# EAGLE design NeoDigito Mini V2 (EAGLE 9.6.2)
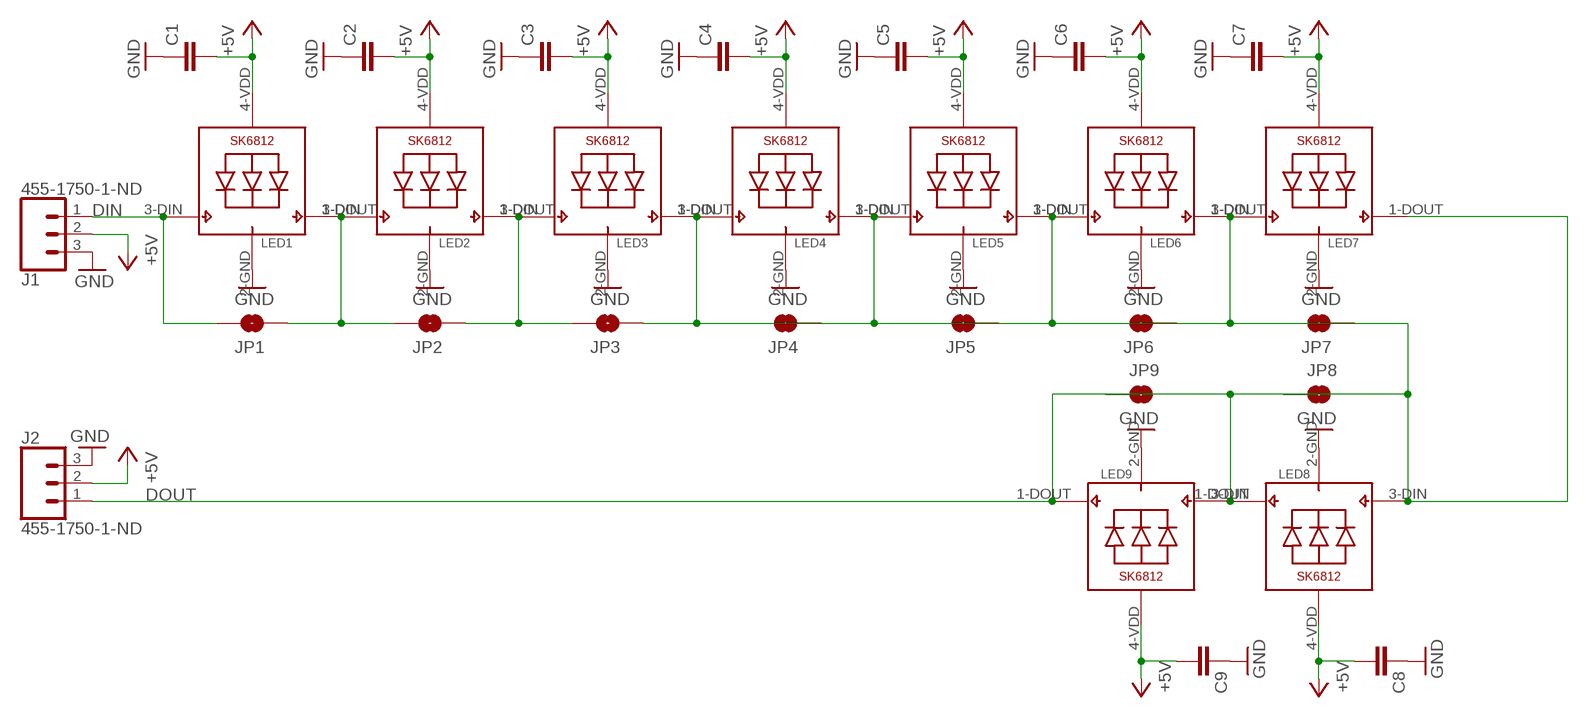
[diagram p0: schematic, sheet 1]

## Parts
C1  C-EUC0805  [C0805]
C2  C-EUC0805  [C0805]
C3  C-EUC0805  [C0805]
C4  C-EUC0805  [C0805]
C5  C-EUC0805  [C0805]
C6  C-EUC0805  [C0805]
C7  C-EUC0805  [C0805]
C8  C-EUC0805  [C0805]
C9  C-EUC0805  [C0805]
J1  455-1750-1-ND  CONN_03  [1X03]
J2  455-1750-1-ND  CONN_03  [1X03]
JP1  JUMPER-SMT_2_NO_SILK  [SMT-JUMPER_2_NO_SILK]
JP2  JUMPER-SMT_2_NO_SILK  [SMT-JUMPER_2_NO_SILK]
JP3  JUMPER-SMT_2_NO_SILK  [SMT-JUMPER_2_NO_SILK]
JP4  JUMPER-SMT_2_NO_SILK  [SMT-JUMPER_2_NO_SILK]
JP5  JUMPER-SMT_2_NO_SILK  [SMT-JUMPER_2_NO_SILK]
JP6  JUMPER-SMT_2_NO_SILK  [SMT-JUMPER_2_NO_SILK]
JP7  JUMPER-SMT_2_NO_SILK  [SMT-JUMPER_2_NO_SILK]
JP8  JUMPER-SMT_2_NO_SILK  [SMT-JUMPER_2_NO_SILK]
JP9  JUMPER-SMT_2_NO_SILK  [SMT-JUMPER_2_NO_SILK]
LED1  SK6812_3535  [LED3535]
LED2  SK6812_3535  [LED3535]
LED3  SK6812_3535  [LED3535]
LED4  SK6812_3535  [LED3535]
LED5  SK6812_3535  [LED3535]
LED6  SK6812_3535  [LED3535]
LED7  SK6812_3535  [LED3535]
LED8  SK6812_3535  [LED3535]
LED9  SK6812_3535  [LED3535]

## Nets
+5V: C1.2 C2.2 C3.2 C4.2 C5.2 C6.2 C7.2 C8.2 C9.2 J1.2 J2.2 LED1.4-VDD(VDD) LED2.4-VDD(VDD) LED3.4-VDD(VDD) LED4.4-VDD(VDD) LED5.4-VDD(VDD) LED6.4-VDD(VDD) LED7.4-VDD(VDD) LED8.4-VDD(VDD) LED9.4-VDD(VDD)
DIN: J1.1 JP1.1 LED1.3-DIN(DI)
DOUT: J2.1 JP9.1 LED9.1-DOUT(DO)
GND: C1.1 C2.1 C3.1 C4.1 C5.1 C6.1 C7.1 C8.1 C9.1 J1.3 J2.3 LED1.2-GND(GND) LED2.2-GND(GND) LED3.2-GND(GND) LED4.2-GND(GND) LED5.2-GND(GND) LED6.2-GND(GND) LED7.2-GND(GND) LED8.2-GND(GND) LED9.2-GND(GND)
N$1: JP1.2 JP2.1 LED1.1-DOUT(DO) LED2.3-DIN(DI)
N$2: JP2.2 JP3.1 LED2.1-DOUT(DO) LED3.3-DIN(DI)
N$3: JP3.2 JP4.2 LED3.1-DOUT(DO) LED4.3-DIN(DI)
N$4: JP4.1 JP5.2 LED4.1-DOUT(DO) LED5.3-DIN(DI)
N$5: JP5.1 JP6.2 LED5.1-DOUT(DO) LED6.3-DIN(DI)
N$6: JP6.1 JP7.2 LED6.1-DOUT(DO) LED7.3-DIN(DI)
N$7: JP8.1 JP9.2 LED8.1-DOUT(DO) LED9.3-DIN(DI)
N$13: JP7.1 JP8.2 LED7.1-DOUT(DO) LED8.3-DIN(DI)

## Library data of the parts
C1-C9 = rcl:C-EU: CAPACITOR, European symbol; SPICEPREFIX: C
J1 J2 = SparkFun-Connectors:CONN_03: Multi connection point. Often used as Generic Header-pin footprint for 0.1 inch spaced/style header connections On any of the 0.1 inch spaced packages, you can populate with these: Break Away Headers - Straight <https://www.sparkfun.com/products/116> (PRT-00116) Break Away Male Headers - Right Angle <https://www.sparkfun.com/products/553> (PRT-00553) Female Headers <https://www.sparkfun.com/products/115> (PRT-00115) Break Away Headers - Machine Pin <https://www.sparkfun.com/products/117> (PRT-00117) Break Away Female Headers - Swiss Machine Pin <https://www.sparkfun.com/products/743> (PRT-00743) Stackable Header - 3 Pin (Female, 0.1") <https://www.sparkfun.com/products/13875> (PRT-13875) For SCREWTERMINALS and SPRING TERMINALS visit here: Screw Terimnals on SparkFun.com <https://www.sparkfun.com/search/results?term=Screw+Terminals> (5mm/3.5mm/2.54mm spacing) This device is also useful as a general connection point to wire up your design to another part of your project. Our various solder wires solder well into these plated through hole pads. Hook-Up Wire - Assortment (Stranded, 22 AWG) <https://www.sparkfun.com/products/11375> (PRT-11375) Hook-Up Wire - Assortment (Solid Core, 22 AWG) <https://www.sparkfun.com/products/11367> (PRT-11367) View the entire wire category on our website here <https://www.sparkfun.com/categories/141> Special notes: Molex polarized connector foot print use with SKU : PRT-08232 with associated crimp pins and housings.; PROD_ID: XXX-00000
JP1-JP9 = SparkFun-Jumpers:JUMPER-SMT_2_NO: Normally open jumper This jumper has two pads in close proximity to each other. Apply solder to close the connection. Round pads are easier to solder for beginners, but are a lot larger. SparkFun Product that uses the round pads: SparkFun EL Sequencer <https://www.sparkfun.com/products/12781>
LED1-LED9 = SK6812:SK6812

## Board
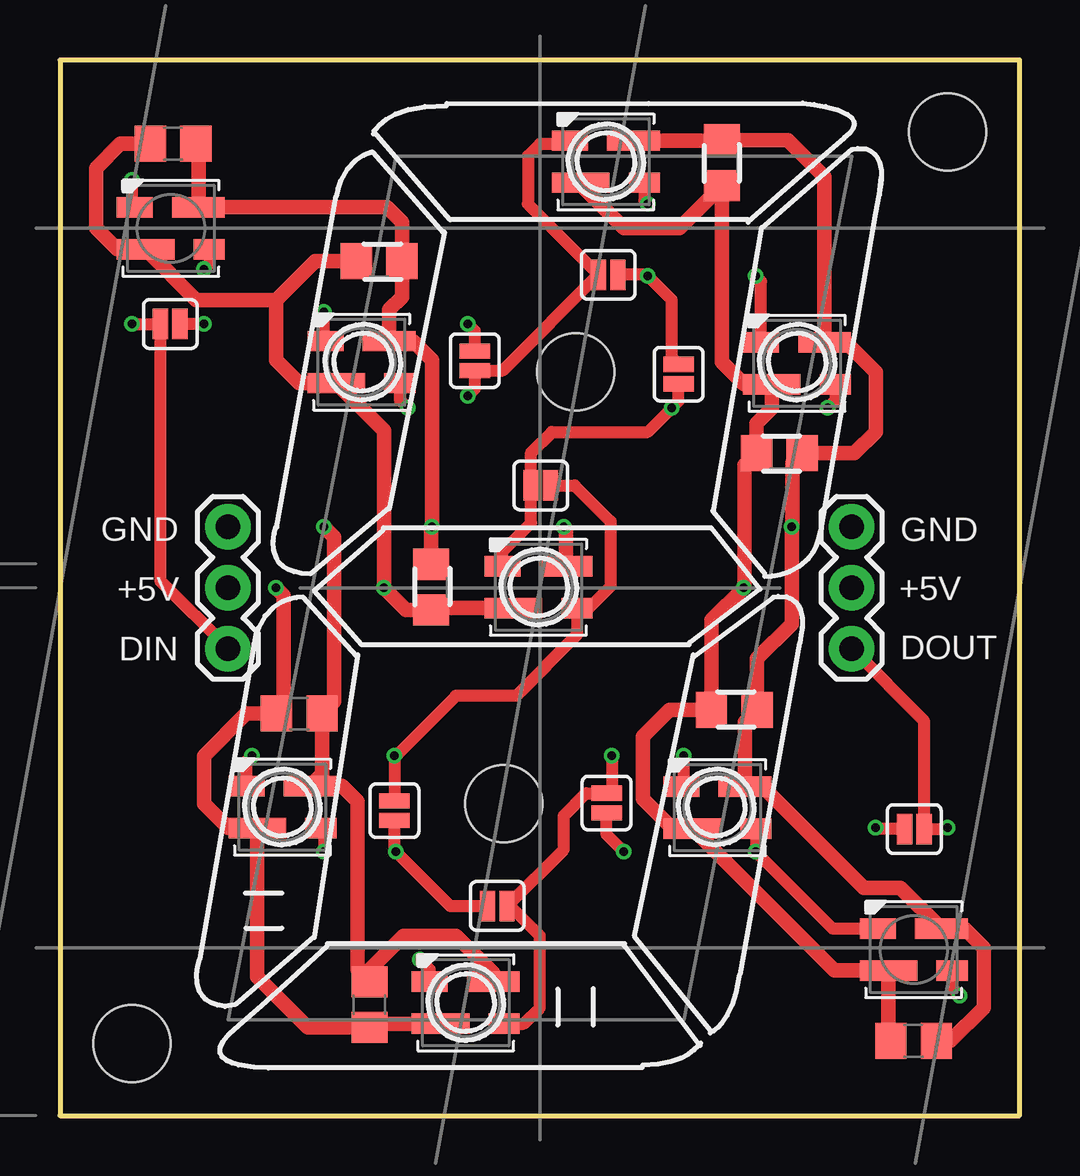
[diagram p1: board, top side]
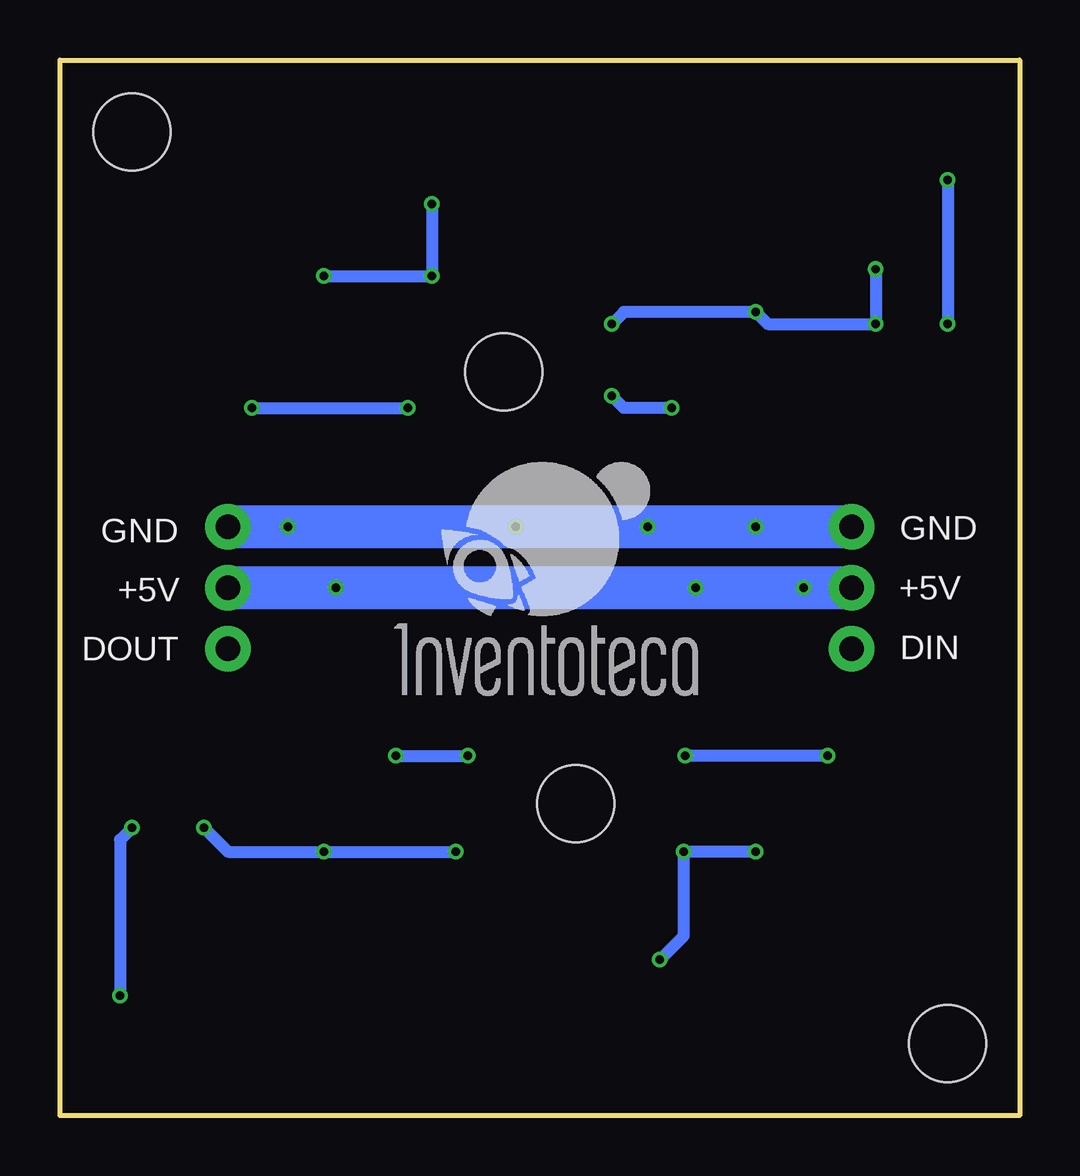
[diagram p2: board, bottom side, seen from below]

Size 40 x 44 mm. Coordinates in mm from the lower left corner, seen from the top.
Outline: 0,0 40,0 40,44 0,44 0,0
Copper layers (1*16): Top 0.035mm / dielectric 1.5mm / Bottom 0.035mm
Design rules "_xircuitos.mx_2L_DRC": minimum track width 6mil, minimum drill 12mil, track to track 6mil, track to pad 6mil, pad to pad 6mil, via to via 6mil, smd to smd 0mil, copper to edge 10mil, drill to drill 12mil, minimum pad ring 10mil, minimum via ring 6mil, stop-mask expansion 2mil, vias tented up to drill 100mil, thermal gap 10mil
Holes 3.2 mm at 3,3 37,41 18.5,13 21.5,31

### Footprints (pad centres in the part's own frame; a part is rotated, then mirrored left to right if it is on the bottom)
C0805 = smd 1.3 x 1.5: 1 -0.95,0; 2 0.95,0
1X03 = drill 1.016 pad 1.88: 1 0,0; 2 2.54,0; 3 5.08,0
SMT-JUMPER_2_NO_SILK = smd 0.635 x 1.27: 1 -0.406,0; 2 0.406,0
LED3535 = smd 1.3 x 0.85: 1-DOUT 1.6,-0.875 | smd 2.2 x 0.85: 2-GND 1.15,0.875 | smd 1.5 x 0.85: 3-DIN -1.5,0.875 | smd 2.4 x 0.85: 4-VDD -1.05,-0.875

### Placement (x,y rotation side)
C1  4.72,40.51 180 top
C2  13.3,35.62 180 top
C3  27.58,39.72 270 top
C4  29.99,27.62 180 top
C5  15.46,22.03 270 top
C6  9.97,16.75 180 top
C7  12.9,4.62 270 top
C8  28.11,16.91 180 top
C9  35.58,3.11 180 top
J1  7,19.46 90 top
J2  33,19.46 90 top
JP1  4.6,32.99 0 top
JP2  17.29,31.46 270 top
JP3  22.86,35.04 0 top
JP4  25.79,30.9 90 top
JP5  20.04,26.26 180 top
JP6  13.94,12.71 90 top
JP7  18.23,8.74 180 top
JP8  22.78,13.03 90 top
JP9  35.61,11.94 180 top
LED1  4.62,36.98 0 top
LED2  12.57,31.41 0 top
LED3  22.76,39.76 0 top
LED4  30.72,31.36 0 top
LED5  19.95,22.03 0 top
LED6  9.27,12.86 0 top
LED7  16.91,4.7 0 top
LED8  27.41,12.84 0 top
LED9  35.59,6.92 0 top

### Tracks (layer width: path | path; a pad name or v marks a point on that pad's centre or on a via)
+5V  (via drill 0.35)
  Top 0.6: 9,34 9,31.5 9.97,30.53 LED2.4-VDD 13.5,28.55 v13.5,22 14.42,21.08 C5.2 15.54,21.15 LED5.4-VDD | 9,34 10.62,35.62 C2.2 | LED3.4-VDD 21.71,38.79 23.5,37 25.82,37 C3.2 27.58,31.42 28.52,30.48 LED4.4-VDD 29.67,29.48 29.04,28.85 C4.2 28.54,27.12 28.54,22.04 v28.5,22 27.16,20.66 C8.2 25.41,16.91 24.3,15.8 24.3,13.2 25.54,11.96 LED8.4-VDD 32.27,6.04 LED9.4-VDD 34.54,3.2 C9.2 | C1.2 2.51,40.51 1.5,39.5 1.5,37 2.39,36.11 LED1.4-VDD 5.68,34 9,34 | v9,22 9.32,21.68 9.32,17.05 C6.2 7.75,16.75 6,15 6,13 7.02,11.98 LED6.4-VDD 8.22,5.78 10.32,3.67 C7.2 13.05,3.83 LED7.4-VDD
  Bottom 1.8: J1.2 v9,22 v13.5,22 v28.5,22 J2.2
DIN  (via drill 0.35)
  Top 0.5: J1.1 4.19,22.27 JP1.1 v3,33 | LED1.3-DIN 3,37.98 v3,39
  Bottom 0.5: v3,39 v3,33
DOUT  (via drill 0.35)
  Top 0.5: v37,12 36.94,11.94 JP9.1 36.02,16.44 J2.1 | v37.5,5 37.19,5.31 LED9.1-DOUT
  Bottom 0.5: v37,12 37.5,11.5 v37.5,5
GND  (via drill 0.35)
  Top 0.6: LED3.2-GND 27.55,40.63 C3.1 30.34,40.66 31.87,39.13 LED4.2-GND 32.77,32.23 34,31 34,28.5 33.12,27.62 C4.1 30.54,27.22 30.54,24.58 v30.5,24.54 30.5,20.5 29.06,19.06 C8.1 28.56,16.41 LED8.2-GND 29.29,13.71 33.5,9.5 35.03,9.5 LED9.2-GND 37.71,7.79 38.5,7 38.5,4.5 37.11,3.11 C9.1 | C1.1 5.77,40.41 LED1.2-GND 13.64,37.86 14.25,37.25 C2.1 14.25,34.12 13.71,33.59 LED2.2-GND 14.72,32.28 15.5,31.5 v15.5,24.54 15.46,24.5 C5.1 | LED5.2-GND 21.1,24.44 v21,24.54 | v11,24.54 11.42,24.12 11.42,17.25 C6.1 10.92,14.24 LED6.2-GND 11.77,13.73 12.4,13.1 12.4,6.08 C7.1 12.9,6.08 14.32,7.5 16.5,7.5 18.07,5.93 LED7.2-GND
  Bottom 1.8: J1.3 v11,24.54 v15.5,24.54 v21,24.54 v30.5,24.54 J2.3
N$1  (via drill 0.35)
  Top 0.5: LED2.3-DIN 11,32.35 v11,33.5 | v6,33 v5.99,32.99 JP1.2 | LED1.1-DOUT 6.22,35.5 v6,35.28 | v17,33 17.29,32.71 JP2.1
  Bottom 0.5: v6,35.28 v6,33 10.5,33 v11,33.5 16.5,33.5 v17,33
N$2  (via drill 0.35)
  Top 0.5: LED2.1-DOUT 14.16,29.84 v14.5,29.5 | v17,30 17.29,30.29 JP2.2 18.46,31.06 JP3.1 19.5,38 19.5,40 20,40.5 21.13,40.5 LED3.3-DIN
  Bottom 0.5: v14.5,29.5 16.5,29.5 v17,30
N$3  (via drill 0.35)
  Top 0.5: LED3.1-DOUT 24.36,38.14 v24.5,38 | JP3.2 24.46,35.04 v24.5,35 25.5,34 25.5,31.6 JP4.2 | LED4.3-DIN 29.22,34.78 v29,35
  Bottom 0.5: v24.5,38 v24.5,35 v29,35
N$4  (via drill 0.35)
  Top 0.5: LED5.3-DIN 18.45,23.52 19.64,24.71 JP5.2 19.64,27.64 20.5,28.5 24.5,28.5 v25.5,29.5 25.79,29.79 JP4.1 | LED4.1-DOUT 32.32,29.82 v32,29.5
  Bottom 0.5: v32,29.5 v25.5,29.5
N$5  (via drill 0.35)
  Top 0.5: JP5.1 21.45,26.26 22.95,24.76 22.95,22.05 22.05,21.15 LED5.1-DOUT 21.55,20.05 19,17.5 16.5,17.5 14,15 v13.94,15 JP6.2 | LED6.3-DIN 7.77,14.77 v8,15
  Bottom 0.5: v8,15 v13.94,15
N$6  (via drill 0.35)
  Top 0.5: LED6.1-DOUT 11,11.86 v11,11 | JP6.1 13.94,11.06 v14,11 16.26,8.74 JP7.2 | LED7.3-DIN 15.41,6.08 v15,6.5
  Bottom 0.5: v11,11 v14,11 14,7.5 v15,6.5
N$7  (via drill 0.35)
  Top 0.5: LED8.1-DOUT v29.01,11.01 v29,11 32.21,7.79 LED9.3-DIN | v23.5,11 22.78,11.72 JP8.1 | JP9.2 34.06,11.94 v34,12
  Bottom 0.5: v23.5,11 v29,11 33,11 v34,12
N$13  (via drill 0.35)
  Top 0.5: LED7.1-DOUT 19.33,3.83 20,4.5 20,7.5 18.76,8.74 JP7.1 21,11.1 21,12.5 21.93,13.43 JP8.2 23,13.65 v23,15 | LED8.3-DIN 26,13.8 v26,15
  Bottom 0.5: v26,15 v23,15

### Text on the board
tPlace: GND | GND | +5V | +5V | DOUT | DIN
bPlace: GND | GND | +5V | +5V | DIN | DOUT